# EAGLE design On Axis Encoder - Single Side (EAGLE 9.6.1)

## Sheet 1 of 7: MCU
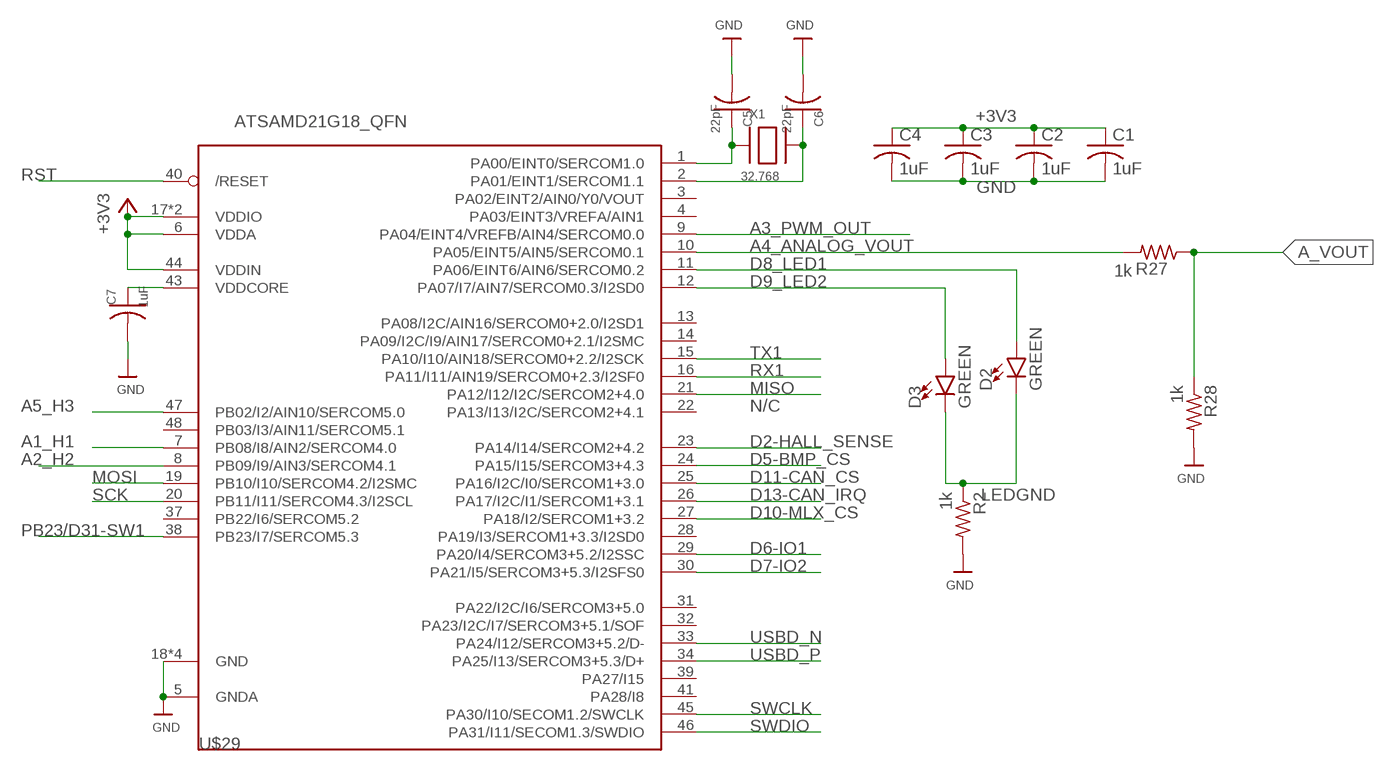
[diagram p0: schematic, sheet 1]

### Parts
C1  1uF  C-USC0603  [C0603]
C2  1uF  C-USC0603  [C0603]
C3  1uF  C-USC0603  [C0603]
C4  1uF  C-USC0603  [C0603]
C5  22pF  C-USC0603  [C0603]
C6  22pF  C-USC0603  [C0603]
C7  1uF  C-USC0603  [C0603]
D2  GREEN  LED-RED0603  [LED-0603]
D3  GREEN  LED-RED0603  [LED-0603]
R2  1k  R-US_R0603  [R0603]
R27  1k  R-US_R0603  [R0603]
R28  1k  R-US_R0603  [R0603]
U$29  ATSAMD21G18_QFN  ATSAMD21J_QFN  [MICROBUILDER_TQFN48_7MM]
X1  32.768  XTAL-3.2X1.5  [XTAL3215]

### Nets
+3V3: C1.1 C2.1 C3.1 C4.1 U$29.6(VDDA) U$29.17(VDDIO) U$29.36(VDDIO) U$29.44(VDDIN) ; also sheet 3,4,5,6
A1_H1: U$29.7(PB08/I8/AIN2/SERCOM4.0) ; also sheet 2
A2_H2: U$29.8(PB09/I9/AIN3/SERCOM4.1)
A3_PWM_OUT: U$29.9(PA04/EINT4/VREFB/AIN4/SERCOM0.0)
A4_ANALOG_VOUT: R27.2 U$29.10(PA05/EINT5/AIN5/SERCOM0.1)
A5_H3: U$29.47(PB02/I2/AIN10/SERCOM5.0)
A_VOUT: R27.1 R28.1 ; also sheet 5
D2-HALL_SENSE: U$29.23(PA14/I14/SERCOM2+4.2)
D5-BMP_CS: U$29.24(PA15/I15/SERCOM3+4.3)
D6-IO1: U$29.29(PA20/I4/SERCOM3+5.2/I2SSC) ; also sheet 5
D7-IO2: U$29.30(PA21/I5/SERCOM3+5.3/I2SFS0)
D8_LED1: D2.A U$29.11(PA06/EINT6/AIN6/SERCOM0.2)
D9_LED2: D3.A U$29.12(PA07/I7/AIN7/SERCOM0.3/I2SD0)
D10-MLX_CS: U$29.27(PA18/I2/SERCOM1+3.2) ; also sheet 3
D11-CAN_CS: U$29.25(PA16/I2C/I0/SERCOM1+3.0) ; also sheet 6
D13-CAN_IRQ: U$29.26(PA17/I2C/I1/SERCOM1+3.1) ; also sheet 6
GND: C1.2 C2.2 C3.2 C4.2 C5.2 C6.2 C7.2 R2.2 R28.2 U$29.5(GNDA) U$29.18(GND) U$29.35(GND) U$29.42(GND) U$29.THERMAL(GND) ; also sheet 2,3,4,5,6
LEDGND: D2.C D3.C R2.1 ; also sheet 4
MISO: U$29.21(PA12/I12/I2C/SERCOM2+4.0) ; also sheet 3,6
MOSI: U$29.19(PB10/I10/SERCOM4.2/I2SMC) ; also sheet 3,6
N$9: C5.1 U$29.1(PA00/EINT0/SERCOM1.0) X1.P$1
N$10: C6.1 U$29.2(PA01/EINT1/SERCOM1.1) X1.P$2
PB23/D31-SW1: U$29.38(PB23/I7/SERCOM5.3)
RST: U$29.40(/RESET) ; also sheet 5
RX1: U$29.16(PA11/I11/AIN19/SERCOM0+2.3/I2SF0)
SCK: U$29.20(PB11/I11/SERCOM4.3/I2SCL) ; also sheet 3,6
SWCLK: U$29.45(PA30/I10/SECOM1.2/SWCLK) ; also sheet 5
SWDIO: U$29.46(PA31/I11/SECOM1.3/SWDIO) ; also sheet 5
TX1: U$29.15(PA10/I10/AIN18/SERCOM0+2.2/I2SCK)
USBD_N [diff pair]: U$29.33(PA24/I12/SERCOM3+5.2/D-) ; also sheet 5
USBD_P [diff pair]: U$29.34(PA25/I13/SERCOM3+5.3/D+) ; also sheet 5
VDDCORE2: C7.1 U$29.43(VDDCORE)
Unconnected: U$29.3(PA02/EINT2/AIN0/Y0/VOUT) U$29.4(PA03/EINT3/VREFA/AIN1) U$29.13(PA08/I2C/AIN16/SERCOM0+2.0/I2SD1) U$29.14(PA09/I2C/I9/AIN17/SERCOM0+2.1/I2SMC) U$29.22(PA13/I13/I2C/SERCOM2+4.1) U$29.28(PA19/I3/SERCOM1+3.3/I2SD0) U$29.31(PA22/I2C/I6/SERCOM3+5.0) U$29.32(PA23/I2C/I7/SERCOM3+5.1/SOF) U$29.37(PB22/I6/SERCOM5.2) U$29.39(PA27/I15) U$29.41(PA28/I8) U$29.48(PB03/I3/AIN11/SERCOM5.1)

### Notes on the sheet
- N/C

## Sheet 2 of 7: PUSH-PULL OUTPUTS
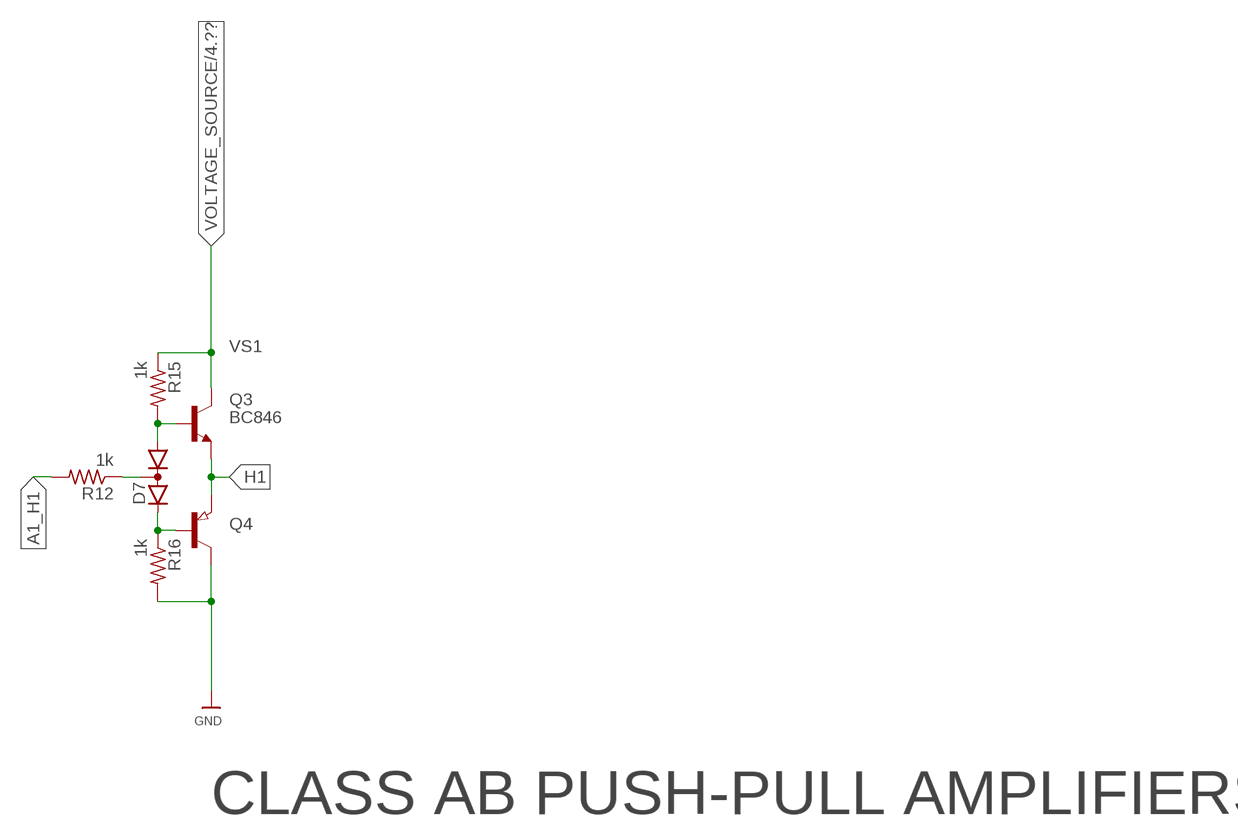
[diagram p1: schematic, sheet 2]

### Parts
D7  DIODE_AC-AC__  [SOT23C]
Q3  BC846  [SOT23]
Q4  PNP-TRANSISTOR_SOT23  [SOT23]
R12  1k  R-US_R0603  [R0603]
R15  1k  R-US_R0603  [R0603]
R16  1k  R-US_R0603  [R0603]

### Nets
A1_H1: R12.2 ; also sheet 1
GND: Q4.3(C) R16.2 ; also sheet 1,3,4,5,6
H1: Q3.2(E) Q4.2(E) ; also sheet 5
N$12: D7.1(K) Q4.1(B) R16.1
N$17: D7.2(A) Q3.1(B) R15.2
N$20: D7.3(AK) R12.1
VS1: Q3.3(C) R15.1

### Notes on the sheet
- CLASS AB PUSH-PULL AMPLIFIERS

## Sheet 3 of 7: MLX Triaxis Hall Effect Sensor
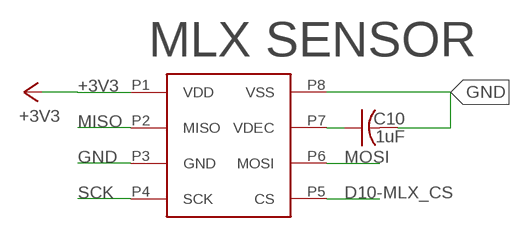
[diagram p2: schematic, sheet 3]

### Parts
C10  1uF  C-USC0603  [C0603]
U$4  MLX90363-SOIC8  [SOIC-8]

### Nets
+3V3: U$4.P1(VDD) ; also sheet 1,4,5,6
D10-MLX_CS: U$4.P5(CS) ; also sheet 1
GND: C10.2 U$4.P3(GND) U$4.P8(VSS) ; also sheet 1,2,4,5,6
MISO: U$4.P2(MISO) ; also sheet 1,6
MOSI: U$4.P6(MOSI) ; also sheet 1,6
N$1: C10.1 U$4.P7(VDEC)
SCK: U$4.P4(SCK) ; also sheet 1,6

### Notes on the sheet
- MLX SENSOR

## Sheet 4 of 7: Voltage Regulator
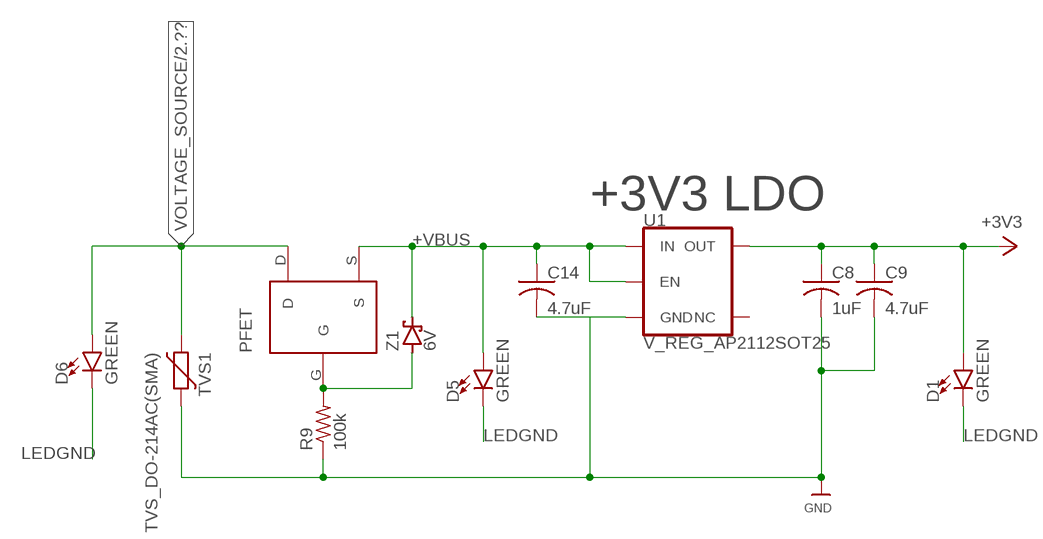
[diagram p3: schematic, sheet 4]

### Parts
C8  1uF  C-USC0603  [C0603]
C9  4.7uF  C-USC0603  [C0603]
C14  4.7uF  C-USC0603  [C0603]
D1  GREEN  LED-RED0603  [LED-0603]
D5  GREEN  LED-RED0603  [LED-0603]
D6  GREEN  LED-RED0603  [LED-0603]
PFET1  PFET  NFET  [SOT323-3_NFET]
R9  100k  R-US_R0603  [R0603]
TVS1  TVS_DO-214AC(SMA)  [DIOM5226X290N]
U1  V_REG_AP2112SOT25  [SOT95P285X140-5N]
Z1  6V  BAS40  [SOT23]

### Nets
+3V3: C8.1 C9.1 D1.A U1.5(OUT) ; also sheet 1,3,5,6
+VBUS: C14.1 D5.A PFET1.S U1.1(IN) U1.3(EN) Z1.3(C) ; also sheet 5
GND: C8.2 C9.2 C14.2 R9.1 TVS1.2 U1.2(GND) ; also sheet 1,2,3,5,6
LEDGND: D1.C D5.C D6.C ; also sheet 1
N$7: PFET1.G R9.2 Z1.1(A)
VOLTAGE_SOURCE: D6.A PFET1.D TVS1.1 ; also sheet 2,5
Unconnected: U1.4(NC)

### Notes on the sheet
- +3V3 LDO
- PFET

## Sheet 5 of 7: Connectors
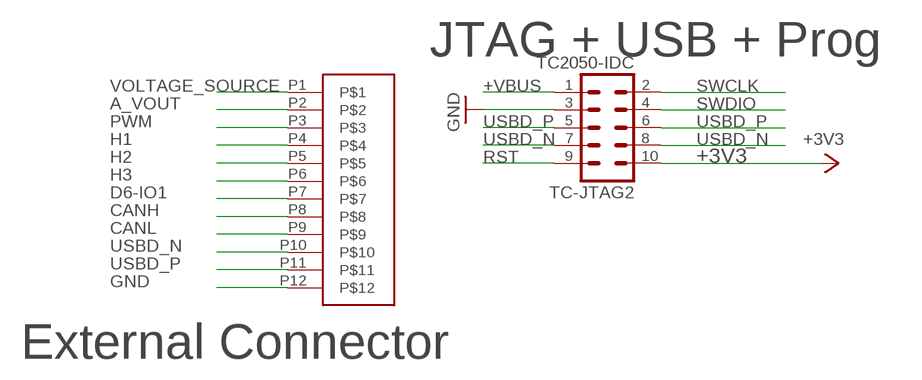
[diagram p4: schematic, sheet 5]

### Parts
TC-JTAG2  TC2050-IDC  [TC2050-IDC]
U$9  BM12B-ZESS-TBT  [JST-BM12B-ZESS-TBT]

### Nets
+3V3: TC-JTAG2.10 ; also sheet 1,3,4,6
+VBUS: TC-JTAG2.1 ; also sheet 4
A_VOUT: U$9.P2 ; also sheet 1
CANH: U$9.P8 ; also sheet 6
CANL: U$9.P9 ; also sheet 6
D6-IO1: U$9.P7 ; also sheet 1
GND: TC-JTAG2.3 U$9.P12 ; also sheet 1,2,3,4,6
H1: U$9.P4 ; also sheet 2
H2: U$9.P5
H3: U$9.P6
PWM: U$9.P3
RST: TC-JTAG2.9 ; also sheet 1
SWCLK: TC-JTAG2.2 ; also sheet 1
SWDIO: TC-JTAG2.4 ; also sheet 1
USBD_N [diff pair]: TC-JTAG2.7 TC-JTAG2.8 U$9.P10 ; also sheet 1
USBD_P [diff pair]: TC-JTAG2.5 TC-JTAG2.6 U$9.P11 ; also sheet 1
VOLTAGE_SOURCE: U$9.P1 ; also sheet 2,4

### Notes on the sheet
- JTAG + USB + Prog
- External Connector

## Sheet 6 of 7: CANbus
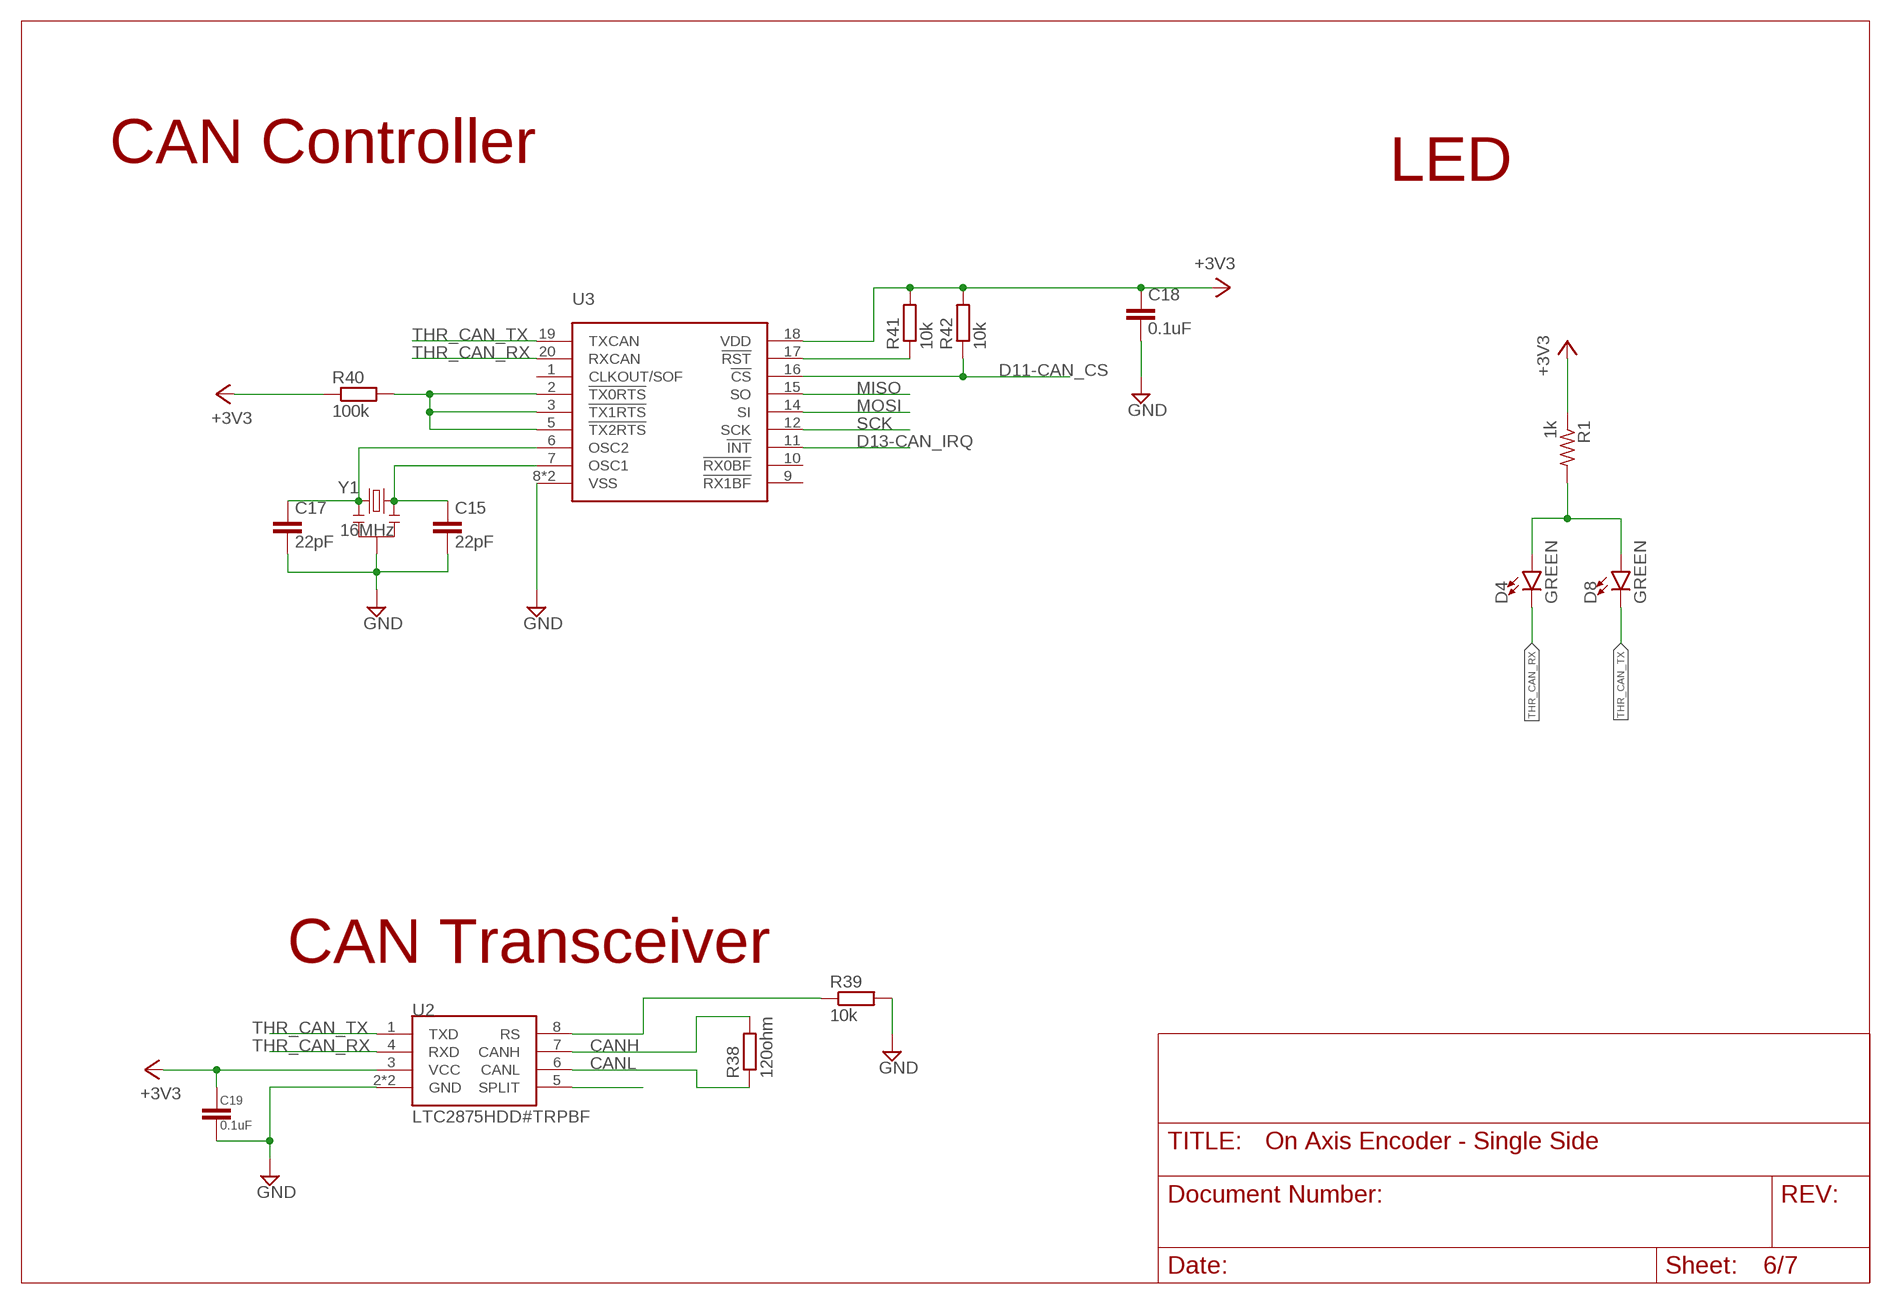
[diagram p5: schematic, sheet 6]

### Parts
C15  22pF  C0603  [C-0603]
C17  22pF  C0603  [C-0603]
C18  0.1uF  C0603  [C-0603]
C19  0.1uF  C0603  [C-0603]
D4  GREEN  LED-RED0603  [LED-0603]
D8  GREEN  LED-RED0603  [LED-0603]
R1  1k  R-US_R0603  [R0603]
R38  120ohm  R0603  [R-0603]
R39  10k  R0603  [R-0603]
R40  100k  R0603  [R-0603]
R41  10k  R0603  [R-0603]
R42  10k  R0603  [R-0603]
U2  LTC2875HDD#TRPBF  LTC2875-8-DFN  [SON50P300X300X80-9T165X238N]
U3  MCP2515-E/ML  MCP2515QFN-20  [QFN50P400X400X100-21T270N]
Y1  16MHz  RESONATORSMD  [RESONATOR-SMD]

### Nets
+3V3: C18.P$1 C19.P$1 R1.1 R40.P$1 R41.P$2 R42.P$2 U2.3(VCC) U3.18(VDD) ; also sheet 1,3,4,5
CANH: R38.P$2 U2.7(CANH) ; also sheet 5
CANL: R38.P$1 U2.6(CANL) ; also sheet 5
D11-CAN_CS: R42.P$1 U3.16(!CS) ; also sheet 1
D13-CAN_IRQ: U3.11(!INT) ; also sheet 1
GND: C15.P$2 C17.P$2 C18.P$2 C19.P$2 R39.P$2 U2.2(GND) U2.9(GND) U3.8(VSS) U3.21(VSS) Y1.2 ; also sheet 1,2,3,4,5
MISO: U3.15(SO) ; also sheet 1,3
MOSI: U3.14(SI) ; also sheet 1,3
N$26: D4.A D8.A R1.2
N$28: R39.P$1 U2.8(RS)
N$29: U2.5(SPLIT)
N$30: R41.P$1 U3.17(!RST)
N$31: R40.P$2 U3.2(!TX0RTS) U3.3(!TX1RTS) U3.5(!TX2RTS)
N$32: C17.P$1 U3.6(OSC2) Y1.3
N$33: C15.P$1 U3.7(OSC1) Y1.1
SCK: U3.12(SCK) ; also sheet 1,3
THR_CAN_RX: D4.C U2.4(RXD) U3.20(RXCAN)
THR_CAN_TX: D8.C U2.1(TXD) U3.19(TXCAN)
Unconnected: U3.1(CLKOUT/SOF) U3.9(!RX1BF) U3.10(!RX0BF)

### Notes on the sheet
- CAN Controller | LED
- CAN Transceiver

## Sheet 7 of 7: 7 DOF IMU

## Library data of the parts
C1-C10 C14 = rcl:C-US: CAPACITOR, American symbol; SPICEPREFIX: C
C15 C17-C19 = Jetfoiler:C
D1-D6 D8 = SparkFun-LED:LED-RED: Red SMD LED Used in manufacturing of most products at SparkFun Packages: 0603 - SMD 0603 package [Product Link] <http://docs.avagotech.com/docs/AV02-0551EN> 0603 SMART - SMD 0603 SMART package ( more efficient and expensive)[Product Link] <http://www.osram-os.com/Graphics/XPic2/00077099_0.pdf> 1206 - SMD1206 package [Product Link] <https://www.sparkfun.com/datasheets/DevTools/LilyPad/Q150OVS4.pdff> SparkFun Products: Pro Mini 328 -5V <https://www.sparkfun.com/products/821> RedBoard <https://www.sparkfun.com/products/12757> IOIO-OTG <https://www.sparkfun.com/products/13613>; PROD_ID: DIO-00819; VALUE: RED
D7 = semicon-smd-ipc:DIODE_AC-AC_: DUAL DIODE
PFET1 = AlecK:NFET: 20V N Channel MOSFET - SOT23-3 - 1A https://www.diodes.com/assets/Datasheets/ds31859.pdf
Q3 = transistor:BC846: NPN TRANSISTOR
Q4 = semicon-smd-ipc:PNP-TRANSISTOR_: PNP TRANSISTOR
R1 R2 R9 R12 R15 R16 R27 R28 = rcl:R-US_: RESISTOR, American symbol; SPICEPREFIX: R
R38-R42 = Jetfoiler:R
TC-JTAG2 = TagConnect:TC2050-IDC: Tag-Connect In Circuit Programming & Debug Cable 10 Pin http://www.tag-connect.com
TVS1 = Circuit-Protection:TVS: TVS Diode - Generic; CATEGORY: Circuit-Protection; SUB-CATEGORY: TVS-Diode
U1 = Jetfoiler:V_REG_AP2112: AP2112 - 600mA CMOS LDO Regulator w/ Enable The AP2112 is CMOS process low dropout linear regulator with enable function, the regulator delivers a guaranteed 600mA (min.) continuous load current. Features Output Voltage Accuracy: ±1.5% Output Current: 600mA (Min.) Foldback Short Current Protection: 50mA Enable Function to Turn ON/OFF VOUT Low Dropout Voltage (3.3V): 250mV (Typ.) @IOUT=600mA Excellent Load Regulation: 0.2%/A (Typ.) Excellent Line Regulation: 0.02%/V (Typ.) Low Quiescent Current: 55μA (Typ.) Low Standby Current: 0.01μA (Typ.) Low Output Noise: 50μVRMS PSRR: 100Hz -65dB, 1kHz -65dB OTSD Protection Stable with 1.0μF Flexible Cap: Ceramic, Tantalum and Aluminum Electrolytic Operation Temperature Range: -40°C to 85°C ESD: MM 400V, HBM 4000V
U2 = Jetfoiler:LTC2875: Datasheet <https://www.analog.com/media/en/technical-documentation/data-sheets/2875f.pdf>
U3 = Jetfoiler:MCP2515
U$4 = AlecK:MLX90363-SOIC8
U$9 = AlecK:BM12B-ZESS-TBT
U$29 = Jetfoiler:ATSAMD21J
X1 = Jetfoiler:XTAL: Low cost SMT crystals, no capacitors included http://www.ladyada.net/library/eagle
Y1 = SparkFun:RESONATOR: Resonator Small SMD resonator. This is the itty bitty 10/20MHz resonators with built in caps. CSTCE10M0G55 and CSTCE20M0V53. Footprint has been reviewed closely but hasn't been tested yet.
Z1 = diode:BAS40: Silicon Schottky Diodes General-purpose diode for high-speed switching

## Net classes
0 default: width 0.089 mm, drill 0.2 mm, clearance 0.089 mm
1 diff pair: width 0.152 mm, drill 0.2 mm, clearance 0.203 mm

## Board
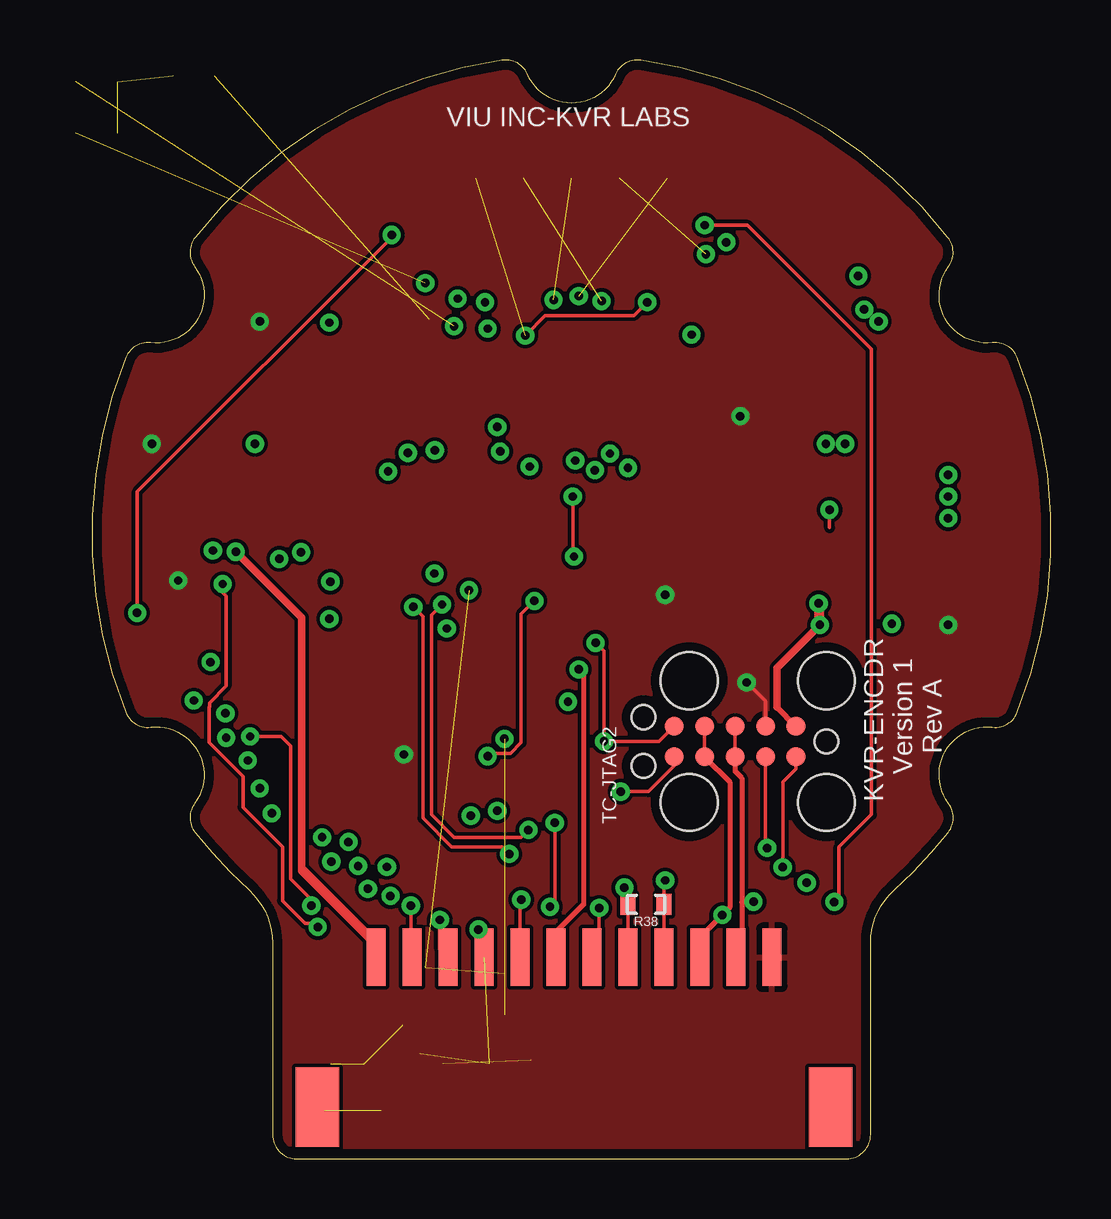
[diagram p6: board, top side]
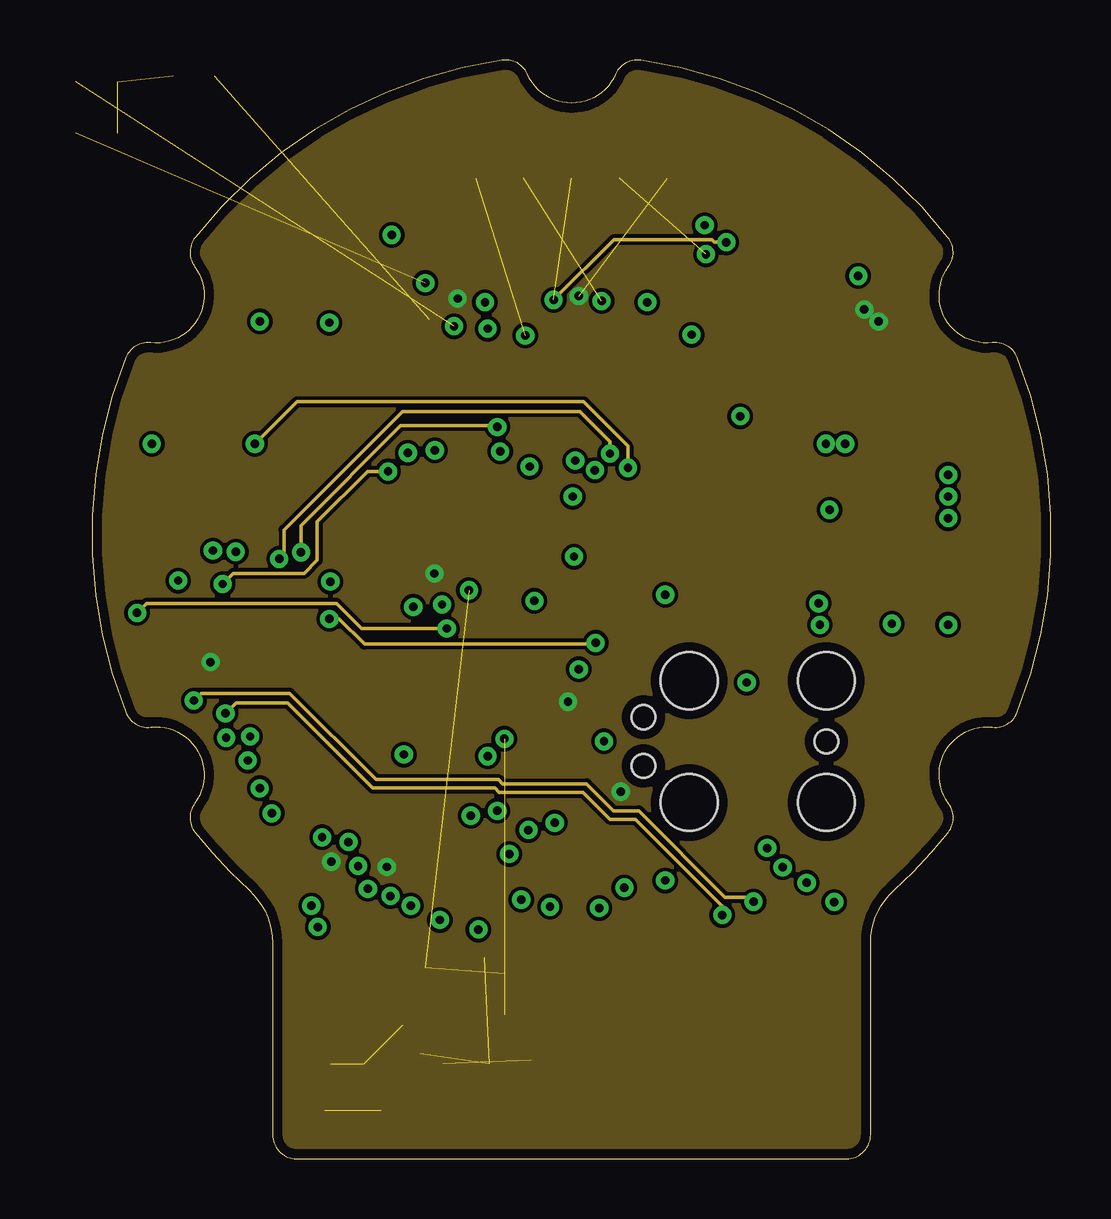
[diagram p7: board, inner layer Route2]
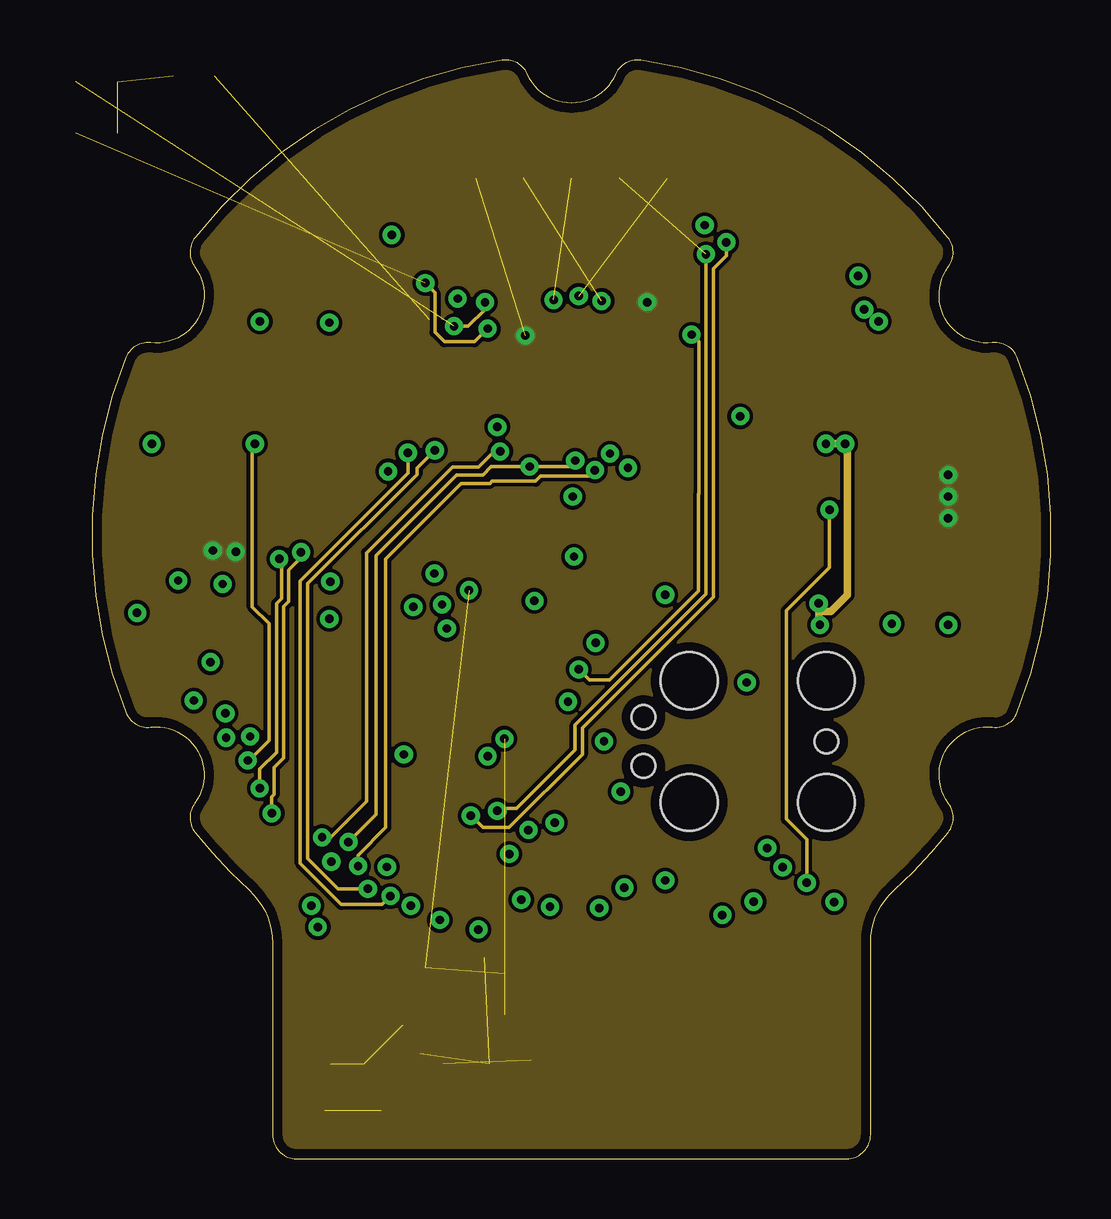
[diagram p8: board, inner layer Route15]
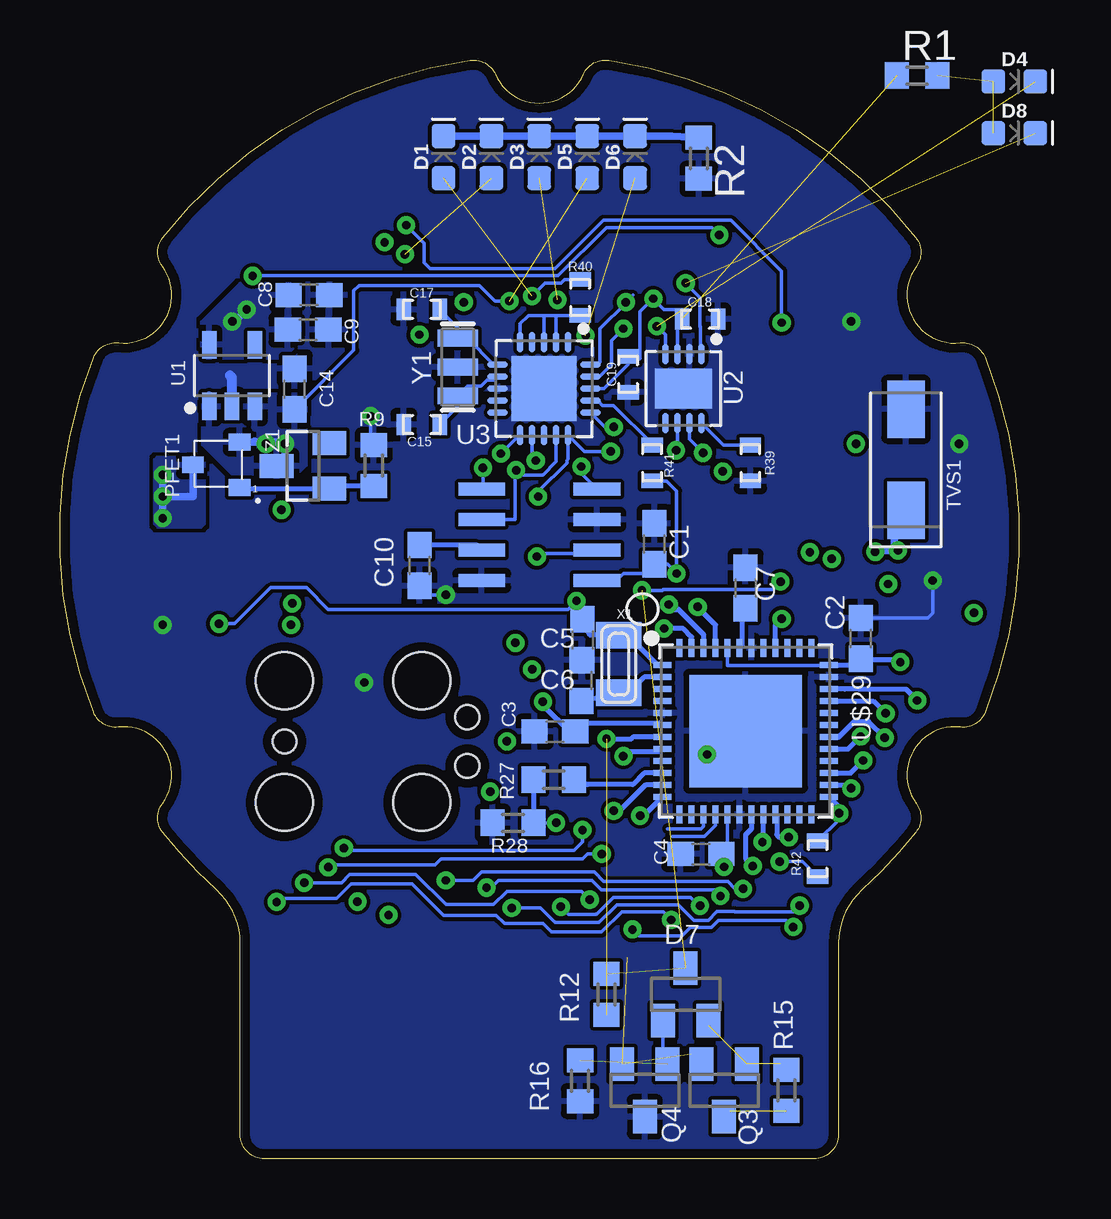
[diagram p9: board, bottom side, seen from below]

Size 39.96 x 45.8 mm. Coordinates in mm from the lower left corner, seen from the top.
Outline: 21.82,45.2 arc-133 18.15,45.2 arc75 17.09,45.79 arc43 4.29,38.4 arc75 4.27,37.19 arc-133 2.44,34.01 arc75 1.4,33.39 arc43 1.4,18.61 arc75 2.44,17.99 arc-133 4.27,14.81 arc75 4.29,13.6 arc9 6.53,11.2 arc-48 7.52,9 7.52,1 arc90 8.52,0 31.45,0 arc90 32.45,1 32.45,9 arc-48 33.43,11.2 arc9 35.68,13.6 arc75 35.69,14.81 arc-133 37.53,17.99 arc75 38.57,18.61 arc43 38.57,33.39 arc75 37.53,34.01 arc-133 35.69,37.19 arc75 35.67,38.4 arc43 22.88,45.79 arc75 21.82,45.2
Copper layers (1*2*15*16): Top 0.035mm / dielectric 1mm / Route2 0.035mm / dielectric 0.18mm / Route15 0.035mm / dielectric 0.18mm / Bottom 0.035mm
Design rules "default *": minimum track width 6mil, minimum drill 0.35mm, track to track 6mil, track to pad 6mil, pad to pad 6mil, via to via 6mil, smd to smd 4mil, copper to edge 16mil, drill to drill 6mil, minimum pad ring 10mil, minimum via ring 8mil, stop-mask expansion 4mil, vias tented up to drill 0mil, thermal gap 10mil

### Footprints (pad centres in the part's own frame; a part is rotated, then mirrored left to right if it is on the bottom)
C0603 = smd 1.1 x 1: 1 -0.85,0; 2 0.85,0
C-0603 = smd 0.61 x 0.889: P$1 -0.749,0; P$2 0.749,0
LED-0603 = smd 1 x 1: A -0.877,0; C 0.877,0
SOT23C = smd 1 x 1.4: 1 -0.95,-1.1; 2 0.95,-1.1; 3 0,1.1
SOT323-3_NFET = smd 0.9 x 0.7: D 1.059,0; G -0.889,0.95; S -0.889,-0.95
SOT23 = smd 1 x 1.4: 1 -0.95,-1.1; 2 0.95,-1.1; 3 0,1.1
R0603 = smd 1 x 1.1: 1 -0.85,0; 2 0.85,0
R-0603 = smd 0.61 x 0.889: P$1 -0.749,0; P$2 0.749,0
TC2050-IDC = smd 0.787 x 0.787: 1 -2.54,-0.635; 2 -2.54,0.635; 3 -1.27,-0.635; 4 -1.27,0.635; 5 0,-0.635; 6 0,0.635; 7 1.27,-0.635; 8 1.27,0.635; 9 2.54,-0.635; 10 2.54,0.635 | hole 0.991: -3.81,0; 3.81,1.016; 3.81,-1.016 | hole 2.375: -3.81,2.54; -3.81,-2.54; 1.905,2.54; 1.905,-2.54
DIOM5226X290N = smd 2.392 x 1.565: 1 -2.108,0; 2 2.108,0
SOT95P285X140-5N = smd 1.146 x 0.597: 1 -1.287,0.95; 2 -1.287,0; 3 -1.287,-0.95; 4 1.287,-0.95; 5 1.287,0.95
SON50P300X300X80-9T165X238N = smd 0.86 x 0.27: 1 -1.435,0.75; 2 -1.435,0.25; 3 -1.435,-0.25; 4 -1.435,-0.75; 5 1.435,-0.75; 6 1.435,-0.25; 7 1.435,0.25; 8 1.435,0.75 | smd 1.65 x 2.38: 9 0,0
QFN50P400X400X100-21T270N = smd 0.837 x 0.264: 1 -1.937,1; 2 -1.937,0.5; 3 -1.937,0; 4 -1.937,-0.5; 5 -1.937,-1; 11 1.937,-1; 12 1.937,-0.5; 13 1.937,0; 14 1.937,0.5; 15 1.937,1 | smd 0.264 x 0.837: 6 -1,-1.937; 7 -0.5,-1.937; 8 0,-1.937; 9 0.5,-1.937; 10 1,-1.937; 16 1,1.937; 17 0.5,1.937; 18 0,1.937; 19 -0.5,1.937; 20 -1,1.937 | smd 2.7 x 2.7: 21 0,0
SOIC-8 = smd 1.95 x 0.55: P1 -2.4,1.9; P2 -2.4,0.63; P3 -2.4,-0.64; P4 -2.4,-1.91; P5 2.4,-1.91; P6 2.4,-0.64; P7 2.4,0.63; P8 2.4,1.9
JST-BM12B-ZESS-TBT = smd 0.8 x 2.4: P1 -8.25,0; P2 -6.75,0; P3 -5.25,0; P4 -3.75,0; P5 -2.25,0; P6 -0.75,0; P7 0.75,0; P8 2.25,0; P9 3.75,0; P10 5.25,0; P11 6.75,0; P12 8.25,0 | smd 1.8 x 3.3: P13 10.7,-6.25; P14 -10.7,-6.25
MICROBUILDER_TQFN48_7MM = smd 0.25 x 0.75: 1 -2.75,-3.475; 2 -2.25,-3.475; 3 -1.75,-3.475; 4 -1.25,-3.475; 5 -0.75,-3.475; 6 -0.25,-3.475; 7 0.25,-3.475; 8 0.75,-3.475; 9 1.25,-3.475; 10 1.75,-3.475; 11 2.25,-3.475; 12 2.75,-3.475; 25 2.75,3.475; 26 2.25,3.475; 27 1.75,3.475; 28 1.25,3.475; 29 0.75,3.475; 30 0.25,3.475; 31 -0.25,3.475; 32 -0.75,3.475; 33 -1.25,3.475; 34 -1.75,3.475; 35 -2.25,3.475; 36 -2.75,3.475 | smd 0.75 x 0.25: 13 3.475,-2.75; 14 3.475,-2.25; 15 3.475,-1.75; 16 3.475,-1.25; 17 3.475,-0.75; 18 3.475,-0.25; 19 3.475,0.25; 20 3.475,0.75; 21 3.475,1.25; 22 3.475,1.75; 23 3.475,2.25; 24 3.475,2.75; 37 -3.475,2.75; 38 -3.475,2.25; 39 -3.475,1.75; 40 -3.475,1.25; 41 -3.475,0.75; 42 -3.475,0.25; 43 -3.475,-0.25; 44 -3.475,-0.75; 45 -3.475,-1.25; 46 -3.475,-1.75; 47 -3.475,-2.25; 48 -3.475,-2.75 | smd 4.7 x 4.7: THERMAL 0,0
XTAL3215 = smd 1.1 x 1.9: P$1 1.2,0; P$2 -1.2,0
RESONATOR-SMD = smd 0.7 x 1.7: 1 -1.2,0; 2 0,0; 3 1.2,0

### Placement (x,y rotation side)
C1  15.18,25.63 90 bottom
C2  6.58,21.69 90 bottom
C3  19.33,17.8 180 bottom
C4  13.24,12.7 180 bottom
C5  18.18,21.63 270 bottom
C6  18.23,19.93 90 bottom
C7  11.38,23.79 90 bottom
C8  29.58,36 0 bottom
C9  29.62,34.55 0 bottom
C10  24.98,24.73 270 bottom
C14  30.18,32.08 90 bottom
C15  24.88,30.6 180 bottom
C17  24.88,35.4 180 bottom
C18  13.28,35 0 bottom
C19  16.28,32.7 270 bottom
D1  23.98,41.75 90 bottom
D2  21.98,41.75 90 bottom
D3  19.98,41.75 90 bottom
D4  0.18,44.9 0 bottom
D5  17.99,41.75 90 bottom
D6  15.99,41.75 90 bottom
D7  13.88,6.85 0 bottom
D8  0.18,42.75 0 bottom
PFET1  33.36,28.92 180 bottom
Q3  12.28,2.85 180 bottom
Q4  15.58,2.85 180 bottom
R1  4.23,45.15 0 bottom
R2  13.33,41.7 270 bottom
R9  26.88,28.89 270 bottom
R12  17.18,6.85 270 bottom
R15  9.68,2.85 90 bottom
R16  18.28,3.25 270 bottom
R27  19.38,15.8 0 bottom
R28  21.08,14 180 bottom
R38  23.08,10.6 180 top
R39  11.18,29 270 bottom
R40  18.28,35.9 270 bottom
R41  15.28,29 270 bottom
R42  8.38,12.5 270 bottom
TC-JTAG2  26.79,17.39 180 top
TVS1  4.7,29.13 90 bottom
U1  32.79,32.64 90 bottom
U2  13.98,32.1 270 bottom
U3  19.78,32.1 270 bottom
U$4  19.98,26 180 bottom
U$9  20.08,8.4 0 top
U$29  11.38,17.82 270 bottom
X1  16.67,20.62 90 bottom
Y1  23.38,33 90 bottom
Z1  29.83,28.88 90 bottom

### Tracks (layer width: path | path; a pad name or v marks a point on that pad's centre or on a via)
+3V3  (via drill 0.35)  (2 unrouted)
  Top 0.152: TC-JTAG2.10 24.25,16.37 23.18,15.3 v22.03,15.3
  Bottom 0.152: U3.18 17.28,32.1 16.28,33.1 16.28,33.35 | 16.28,33.35 C19.P$1 | 14.18,35 C18.P$1 | U2.3 14.23,34.95 14.18,35 | 14.18,35 13.78,35.4 14.78,35.4 v15.23,35.85 15.78,35.3 15.78,33.35 16.28,33.35 | U$4.P1 16.78,24.1 16.48,24.4 15.58,24.4 15.48,24.3 15.18,24.6 C1.1 | R40.P$1 18.92,36.65 19.08,36.49 19.75,36.49 v20.28,35.96 | C1.1 14.99,24.78 | C1.1 14.65,24.78 v14.26,24.39 14.26,27.83 14.68,28.25 R41.P$2 | R42.P$2 9.02,12.38 v9.97,12.38 | U$29.17 12.13,12.96 C4.1 12.39,12.27 v12.28,12.16 | U$29.44 12.13,20.55 7.93,20.55 U$29.36 | C2.1 6.54,20.8 | C2.1 6.76,20.84 7.03,20.57 | C2.1 6.6,20.84 6.87,20.57
  Bottom 0.2: U$29.6 14.96,18.17 18.11,18.17 C3.1 18.73,17.8 19.83,18.9 v19.83,19.05 | U$29.36 7.03,20.57 6.87,20.57 | 6.54,20.8 4.93,20.8 v4.93,20.7
  Bottom 0.305: v32.78,34.9 32.68,34.9 v32.18,35.4
  pour Route2 (isolate 0.127, rank 6): -8.82,51.5 -8.82,-7 47.48,-7 47.48,51.5
  pour Bottom (isolate 0.1): 33.33,33.35 30.63,33.35 29.93,34.05 29.93,36.5 32.48,36.5 34.08,34.9 34.08,33.35
+VBUS  (via drill 0.35)  (1 unrouted)
  Top 0.25: 28.53,18.82 TC-JTAG2.1
  Top 0.305: v30.33,22.25 30.28,22.2 28.53,20.45 28.53,18.82
  Top 0.406: v30.28,23.15 30.28,22.2
  Route15 0.305: v30.33,22.25 30.28,22.3 30.28,22.8 | 30.28,22.8 v30.28,23.15 | v30.58,29.8 v31.38,29.8 31.48,29.7 31.48,23.5 30.78,22.8 30.28,22.8
  Bottom 0.152: v21.23,35.75 21.83,35.75 22.48,36.4 27.5,36.4 27.72,36.19 27.72,33.7 C14.1
  Bottom 0.2: PFET1.S
  Bottom 0.305: PFET1.S 31.88,29.87 | 31.88,29.87 30.65,29.87 v30.58,29.8 30.58,29.23 | 31.84,29.91 31.88,29.87 | U1.1 33.74,31.84
  pour Bottom (isolate 0.1): 34.03,31.9 34.03,29.75 32.78,28.5 32.73,28.5 32.63,28.4 30.18,28.4 29.68,28.9 29.68,31.85 29.73,31.9
A1_H1  (via drill 0.35)  (1 unrouted)
  Bottom 0.2: v17.18,17.5 16.15,17.5 16.08,17.57 U$29.7
A2_H2  (via drill 0.35)
  Top 0.152: 33.28,22.35 v33.33,22.3 | v16.48,16.78 16.6,16.89 17.43,16.89 17.88,17.34 17.88,22.7 v18.43,23.25
  Bottom 0.152: v18.43,23.25 18.78,22.9 28.78,22.9 29.68,23.8 31.18,23.8 32.68,22.3 v33.33,22.3
  Bottom 0.2: v16.48,16.78 16.28,16.98 14.95,16.98 U$29.8
A4_ANALOG_VOUT
  Bottom 0.2: U$29.10 15.61,16.07 16.08,15.6 17.98,15.6 18.28,15.6 18.33,15.6 R27.2
A5_H3  (via drill 0.35)
  Top 0.152: 12.43,38.46 v12.48,38.51 12.48,38.4 1.88,27.8 v1.88,22.75 v1.87,22.75
  Route2 0.152: v14.78,22.1 11.23,22.1 10.18,23.15 2.27,23.15 v1.87,22.75
  Bottom 0.152: v31.93,36.8 19.2,36.8 17.19,38.81 12.78,38.81 v12.48,38.51
  Bottom 0.2: U$29.47 13.63,21.75 13.98,22.1 v14.78,22.1
A_VOUT  (via drill 0.35)
  Top 0.152: v19.28,14 19.28,10.7 v19.08,10.5 | v13.28,10.55 13.28,8.45 U$9.P2
  Bottom 0.152: R28.1 v19.28,14 | v19.08,10.5 18.78,10.19 17.63,10.19 17.62,10.2 17.58,10.2 16.89,10.89 13.68,10.89 13.33,10.55 v13.28,10.55
  Bottom 0.2: R27.1 R28.1
CANH  (via drill 0.35)
  Top 0.152: U$9.P8 22.33,11.15 v22.18,11.3 22.18,10.75 R38.P$2
  Route15 0.152: v13.16,29.43 13.16,28.57 8.67,24.09 8.67,12.31 10.38,10.6 12.08,10.6 v12.43,10.95
  Bottom 0.152: U2.7 13.73,30 v13.16,29.43 | v22.18,11.3 21.98,11.3 21.68,11.6 17.78,11.6 17.38,11.2 12.68,11.2 v12.43,10.95
CANL  (via drill 0.35)
  Top 0.152: U$9.P9 R38.P$1 | v23.88,11.6 23.83,11.55 R38.P$1 | R38.P$1
  Route15 0.152: v14.28,29.53 13.53,28.78 13.53,28.52 8.99,23.97 8.99,13.66 8.98,13.65 8.98,12.52 10.24,11.25 v11.49,11.25
  Bottom 0.152: U2.6 14.23,29.58 v14.28,29.53 | v23.88,11.6 22.74,11.6 22.4,11.95 17.69,11.95 17.3,11.56 12.13,11.56 11.82,11.25 v11.49,11.25
D6-IO1  (via drill 0.35)
  Top 0.152: v21.13,10.45 21.13,8.7 U$9.P7 | v9.13,10.55 9.13,10.8 8.27,11.67 8.27,17.22 7.88,17.6 v6.58,17.6
  Bottom 0.152: v21.13,10.45 19.93,10.45 19.33,9.84 17.49,9.84 16.74,10.59 14.18,10.59 13.53,9.94 12.94,9.94 12.58,10.3 11.84,10.3 11.83,10.29 9.39,10.29 v9.13,10.55
  Bottom 0.2: U$29.29 7.11,17.07 v6.58,17.6
D7-IO2  (via drill 0.35)
  Bottom 0.2: U$29.30 7.5,17.57 6.84,18.23 6.26,18.23 v5.58,17.55
D8_LED1  (via drill 0.35)  (1 unrouted)
  Route15 0.152: v25.58,37.7 25.58,34.61 25.59,34.6 25.59,27.58 25.58,27.57 25.58,23.53 20.13,18.08 20.13,17.05 17.68,14.6 16.98,14.6 v16.88,14.5
  Bottom 0.2: U$29.11 15.56,15.57 16.63,14.5 v16.88,14.5
D9_LED2  (via drill 0.35)  (1 unrouted)
  Route2 0.152: v26.43,38.2 25.94,38.2 25.83,38.31 21.74,38.31 v19.23,35.8
  Route15 0.152: v26.43,38.2 26.43,37.65 25.89,37.11 25.89,34.73 25.89,23.41 20.43,17.95 20.43,16.85 17.38,13.8 16.28,13.8 v15.78,14.3
  Bottom 0.2: U$29.12 15.63,14.3 v15.78,14.3
D10-MLX_CS  (via drill 0.35)
  Route2 0.152: v6.78,29.8 8.53,31.55 20.48,31.55 22.33,29.7 v22.33,28.8
  Route15 0.152: v6.48,16.6 6.53,16.6 7.37,17.44 7.37,22.31 6.68,23.01 6.68,29.69 v6.78,29.8
  Bottom 0.152: U$4.P5 22.33,27.96 v22.33,28.8
  Bottom 0.2: U$29.27 7.01,16.07 v6.48,16.6
D11-CAN_CS  (via drill 0.35)
  Route2 0.152: v16.88,30.5 16.83,30.55 12.86,30.55 8.7,26.39 v8.7,25.28
  Route15 0.152: v8.7,25.28 8.7,25.05 8.19,24.54 8.19,23.22 7.99,23.02 7.99,16.7 7.58,16.3 7.58,15.7 7.59,15.69 7.59,15.19 7.48,15.08 v7.48,14.4
  Bottom 0.152: U3.16 17.25,30.5 v16.88,30.5 | R42.P$1 7.48,14.15 v7.48,14.4
  Bottom 0.2: U$29.25 7.48,14.64 v7.48,14.4
D13-CAN_IRQ  (via drill 0.35)
  Route2 0.152: v21.58,29.39 21.58,29.89 20.33,31.15 12.93,31.15 7.99,26.21 7.99,25.2 v7.79,25
  Route15 0.152: v7.79,25 7.84,25 7.92,24.92 7.89,24.89 7.89,23.35 7.68,23.14 7.68,18.75 7.68,16.94 6.98,16.24 v6.98,15.44
  Bottom 0.152: U3.11 20.81,30.16 v21.58,29.39 | v6.98,15.44 7.02,15.48 7.04,15.48
  Bottom 0.2: U$29.26 7.13,15.57 7.04,15.48
GND  (via drill 0.35)
  Top 0.152: TC-JTAG2.3 28.06,19.07 v27.28,19.85
  Bottom 0.152: C10.2 24.61,23.51 v23.88,23.51 | R9.1 27.01,29.87 v27.01,30.95 | C2.2 3.79,22.54 3.58,22.75 v3.58,24.1 | v12.99,16.85 12.02,17.82 U$29.THERMAL 10.03,16.47 10.03,16.1
  Bottom 0.406: U1.2 32.79,32.56 32.88,32.65
  other vias: 35.68,22.25 2.48,29.8 6.98,34.9
  pour Top (isolate 0.127, rank 6): -11.37,52.7 -11.37,-8.5 49.33,-8.5 49.33,52.7
  pour Bottom (isolate 0.127, rank 6): -4.42,47.45 -4.42,-3.2 42.48,-3.2 42.48,47.45
H1  (via drill 0.35)  (2 unrouted)
  Top 0.152: 12.28,28.6 v12.33,28.65 | U$9.P4 16.33,9.32 v16.1,9.56 | v5.44,23.95 5.44,23.6 5.58,23.45 5.58,19.7 4.89,19.01 4.89,18.83 4.88,18.82 4.88,17.35 5.88,16.36 5.88,16.35 6.28,15.94 6.28,14.65 7.93,13 7.93,10.75 8.88,9.81 9.25,9.81 v9.4,9.66
  Route2 0.152: v12.33,28.65 11.48,28.65 9.38,26.55 9.38,24.95 8.83,24.39 5.88,24.39 v5.44,23.95
  Bottom 0.152: 13.66,4.38 Q3.2 | v16.1,9.56 15.84,9.3 14.04,9.3 13.68,9.65 13.67,9.65 13.66,9.64 12.81,9.64 12.52,9.93 9.68,9.93 v9.4,9.66
  Bottom 0.2: Q3.2 13.63,3.55
H2  (via drill 0.35)
  Top 0.152: 30.73,26.3 v30.73,27.05 | U$9.P5 17.83,10.75 v17.88,10.8
  Route15 0.152: v29.78,11.5 29.78,13.31 28.93,14.16 28.93,22.85 30.73,24.65 v30.73,27.05
  Bottom 0.152: v17.88,10.8 18.23,11.14 21.34,11.14 21.89,10.6 23.88,10.6 25.13,11.85 27.88,11.85 28.23,11.5 v29.78,11.5
H3  (via drill 0.35)
  Top 0.152: 25.03,34.3 v24.98,34.35
  Top 0.2: U$9.P6 19.33,9.45 20.48,10.6 20.48,20.2 v20.28,20.4
  Route15 0.152: v24.98,34.35 25.28,34.05 25.28,27.7 25.28,23.66 21.57,19.95 20.73,19.95 v20.28,20.4
LEDGND
  Bottom 0.305: R2.1 14.46,42.63 D6.C D5.C D3.C D2.C D1.C
MISO  (via drill 0.35)
  Top 0.152: v20.03,27.6 20.03,25.15 v20.08,25.1
  Route15 0.152: 9.58,13.5 v9.58,13.4 9.93,13.4 11.43,14.9 11.43,25.25 15.01,28.83 16.1,28.83 16.75,29.48 v17,29.48
  Bottom 0.152: U$4.P2 17.73,25.22 19.96,25.22 v20.08,25.1 | v17,29.48 18.1,29.48 U3.15 18.78,29.16 18.84,29.1 18.84,28.99 20.03,27.8 v20.03,27.6
  Bottom 0.2: U$29.21 10.08,14.29 10.08,13.5 9.98,13.4 v9.58,13.4
MOSI  (via drill 0.35)
  Route15 0.152: v11.08,12.2 11.08,12.65 12.23,13.8 12.23,25 15.38,28.14 15.37,28.15 16.58,28.15 16.68,28.24 18.48,28.24 18.69,28.45 20.7,28.45 v20.95,28.7
  Bottom 0.152: U$4.P6 21,26.64 21,28.5 | v20.95,28.7 21,28.65 21,28.5 | U3.14 19.28,29.05 19.84,28.49 20.38,28.49 20.39,28.5 21,28.5
  Bottom 0.2: 11.08,14.29 U$29.19 11.13,13.75 11.38,13.5 11.38,12.5 v11.08,12.2
N$1
  Bottom 0.2: U$4.P7 22.59,25.58 C10.1
N$7
  Bottom 0.2: R9.2 28.62,28.04 Z1.1 32.43,27.93 PFET1.G
N$9
  Bottom 0.2: C5.1 17.86,21.82 X1.P$1 16.3,21.82 15.05,20.57 U$29.1
N$10
  Bottom 0.2: C6.1 X1.P$2 | X1.P$2 | U$29.2 15.61,20.07 16.26,19.42 X1.P$2
N$12  (1 unrouted)
  Bottom 0.152: 14.83,4.15 D7.1
  Bottom 0.2: Q4.1 14.83,4.15
N$17  (2 unrouted)
  Bottom 0.152: 12.93,5.55 D7.2 | R15.2 9.93,3.95
N$20  (via drill 0.35)  (2 unrouted)
  Bottom 0.152: D7.3 13.48,7.95 | v15.71,23.69 14.85,23.69 14.82,23.72 10.26,23.72 v9.93,24.05
N$26  (2 unrouted)
N$28
  Bottom 0.152: U2.8 12.32,29.75 R39.P$1
N$30
  Bottom 0.152: R41.P$1 15.28,29.8 16.88,31.4 17.35,31.4 17.55,31.6 U3.17
N$31
  Bottom 0.152: U3.5 20.78,34.8 20.43,35.15 19.78,35.15 | R40.P$2 19.33,35.15 | 19.33,35.15 19.78,35.15 | 19.33,35.15 19.28,35.1 U3.2 | U3.3 19.78,35.15
N$32
  Bottom 0.152: C17.P$1 23.38,34.65 Y1.3 22.98,34.2 21.88,33.1 U3.6
N$33
  Bottom 0.152: C15.P$1 23.38,31.35 Y1.1 22.98,32.2 22.42,32.2 22.16,32.46 21.86,32.46 U3.7
PWM  (via drill 0.35)
  Top 0.152: v9.87,34.84 v9.88,34.85 | v30.93,10.7 31.13,10.9 31.13,13 32.48,14.35 32.48,33.75 27.32,38.91 v25.53,38.91 | U$9.P3 14.49,8.75 v14.49,9.95
  Bottom 0.152: v9.88,34.85 9.88,37 12,39.12 17.32,39.12 19.33,37.11 24.53,37.11 24.78,37.36 24.78,38.16 v25.53,38.91 | v30.93,10.7 30.78,10.85 28.43,10.85 27.83,11.45 25.28,11.45 23.98,10.15 21.78,10.15 21.43,9.8 19.83,9.8 19.48,9.45 17.38,9.45 16.55,10.29 14.82,10.29 v14.49,9.95
RST  (via drill 0.35)
  Top 0.152: TC-JTAG2.9 23.63,17.4 v21.33,17.4 21.33,18.82 21.32,18.83 21.32,21.16 v20.98,21.5
  Route2 0.152: v20.98,21.5 20.93,21.45 11.35,21.45 10.3,22.5 v9.88,22.5
  Bottom 0.2: U$29.40 10.13,22.25 v9.88,22.5
RX1
  Bottom 0.152: U$29.16 12.63,13.9 13.1,13.44 14.43,13.44
SCK  (via drill 0.35)
  Route15 0.152: v10.68,13.2 11.83,14.35 11.83,25.15 15.18,28.5 16.28,28.5 16.63,28.85 v18.23,28.85 19.88,28.85 v20.13,29.1
  Bottom 0.152: U$4.P4 18.23,28.56 v18.23,28.85 | U3.12 20.28,29.25 v20.13,29.1
  Bottom 0.2: v10.68,13.2 10.63,13.25 U$29.20
SWCLK  (via drill 0.35)
  Top 0.152: TC-JTAG2.2 29.33,16.25 28.78,15.7 v28.78,12.15 | v13.38,23 13.78,22.6 13.78,14.2 14.98,13 17.08,13 v17.38,12.7
  Bottom 0.152: v17.38,12.7 17.98,12.7 18.18,12.5 24.08,12.5 24.33,12.25 28.68,12.25 v28.78,12.15
  Bottom 0.2: U$29.45 12.63,22.25 v13.38,23
SWDIO  (via drill 0.35)
  Top 0.152: TC-JTAG2.4 28.06,13.02 v28.13,12.95 | v18.18,13.7 17.88,13.4 15.08,13.4 14.14,14.35 14.14,22.66 v14.58,23.1
  Bottom 0.152: v18.18,13.7 18.18,13.2 18.53,12.85 28.03,12.85 v28.13,12.95
  Bottom 0.2: v14.58,23.1 14.38,22.9 14.18,22.9 13.13,21.85 U$29.46
THR_CAN_RX  (via drill 0.35)  (1 unrouted)
  Route15 0.152: v16.37,35.7 16.37,35.4 15.67,34.7 v15.08,34.7
  Bottom 0.152: U2.4 14.73,34.35 v15.08,34.7 | U3.20 17.55,33.1 17.45,33.2 17.45,34.6 16.37,35.67 v16.37,35.7 16.08,35.99
THR_CAN_TX  (via drill 0.35)  (1 unrouted)
  Route15 0.152: v16.48,34.6 15.93,34.05 14.68,34.05 14.28,34.45 14.28,36.1 v13.88,36.5
  Bottom 0.152: U2.1 13.27,33.57 13.27,34.68 13.28,34.69 13.28,35.9 v13.88,36.5 | U3.19 17.48,32.6 16.98,33.1 16.98,34.1 v16.48,34.6
TX1
  Bottom 0.152: U$29.15 13.13,13.85 13.24,13.74 14.35,13.74 14.36,13.75 14.63,13.75
USBD_N  (via drill 0.35)
  Top 0.152: TC-JTAG2.8 TC-JTAG2.7 | 25.33,9.22 U$9.P10
  Top 0.2: TC-JTAG2.8 26.58,15.7 26.58,10.47 v26.27,10.16 25.33,9.22
  Route2 0.152: v5.55,18.56 5.99,19 8.14,19 11.69,15.45 16.79,15.45 16.96,15.27 20.46,15.27 21.59,14.14 22.64,14.14 26.27,10.51 v26.27,10.16
  Bottom 0.2: U$29.33 6.06,19.07 v5.55,18.56
USBD_P  (via drill 0.35)
  Top 0.152: TC-JTAG2.6 TC-JTAG2.5 | v27.56,10.72 27.55,10.7 | 27.08,8.65 U$9.P11
  Top 0.2: TC-JTAG2.6 26.79,16.16 27.08,15.87 27.08,10.7 | 27.55,10.7 27.08,10.7 | 27.08,10.7 27.08,8.65
  Route2 0.152: v4.23,19.1 4.53,19.4 8.24,19.4 11.84,15.8 16.94,15.8 17.11,15.63 20.6,15.63 21.73,14.5 22.78,14.5 26.38,10.9 27.28,10.9 27.46,10.72 v27.56,10.72
  Bottom 0.2: v4.23,19.1 4.7,19.57 6.65,19.57 6.67,19.59 7.23,19.59 7.26,19.57 U$29.34
VDDCORE2
  Bottom 0.2: U$29.43 11.53,21.39 11.53,22.7 11.38,22.85 C7.1
VOLTAGE_SOURCE  (via drill 0.35)  (1 unrouted)
  Top 0.152: 18.05,34.03 v18.05,34.31 18.88,35.14 21.48,35.14 21.49,35.15 22.58,35.15 v23.13,35.7
  Top 0.305: 8.78,12 8.73,12.05 8.73,22.55 v5.98,25.3
  Top 0.406: 8.78,12 11.78,9 11.83,9
  Top 0.61: U$9.P1 11.83,9
  Bottom 0.305: v35.68,27.6 34.42,27.6 PFET1.D | v35.68,28.5 v35.68,26.7 | v5.03,25.35 5.18,25.35 | 5.18,25.35 5.93,25.35 v5.98,25.3 | TVS1.1 5.18,26.54 5.18,25.35
  pour Route15 (isolate 0.127, rank 6): -7.07,49.5 -7.07,-5.25 45.08,-5.25 45.08,49.5
  pour Bottom (isolate 0.1): 35.88,26.3 34.08,26.3 33.93,26.45 33.93,29.25 35.93,29.25 36.03,29.15 36.03,26.45
VS1  (1 unrouted)
  Bottom 0.152: Q3.3 12.03,2

### Text on the board
tNames: VIU INC-KVR LABS | KVR-ENCDR / Version 1 / Rev A